# EAGLE design V2_lite (EAGLE 8.5.1)

## Sheet 1 of 8: ATMEGA328p
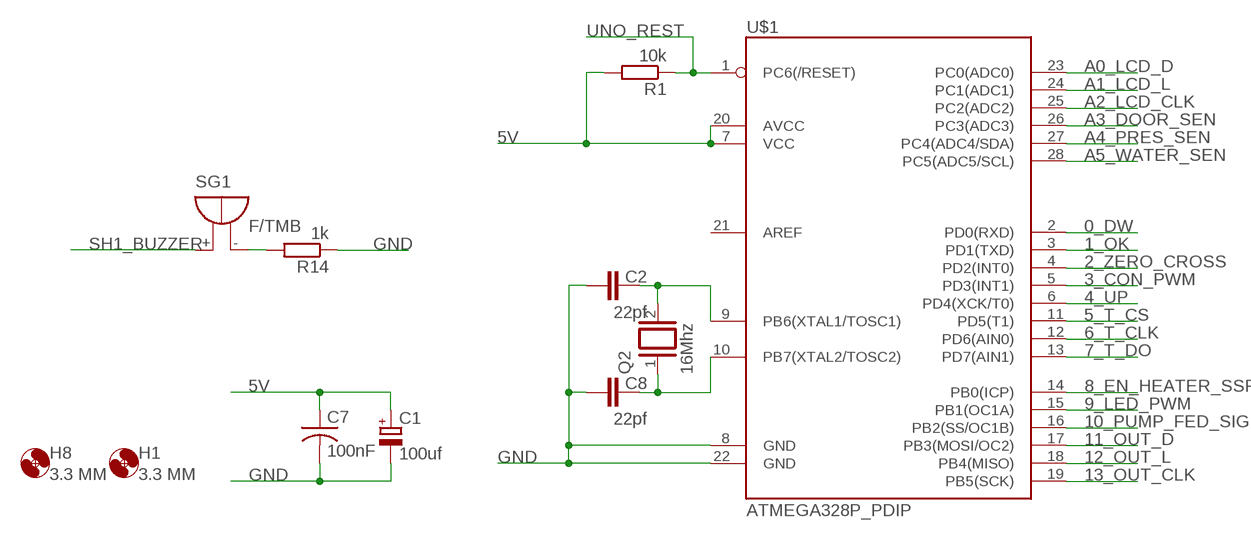
[diagram p0: schematic, sheet 1]

### Parts
C1  100uf  CPOL-EUE3.5-8  [E3,5-8]
C2  22pf  C-EU050-030X075  [C050-030X075]
C7  100nF  C-US050-035X075  [C050-035X075]
C8  22pf  C-EU050-030X075  [C050-030X075]
H1  3.3 MM  MOUNT-HOLE3.3  [3,3]
H8  3.3 MM  MOUNT-HOLE3.3  [3,3]
Q2  16Mhz  XTAL/S  [QS]
R1  10k  R-EU_0207/10  [0207/10]
R14  1k  R-EU_0207/10  [0207/10]
SG1  F/TMB  [F/TMB]
U$1  ATMEGA328P_PDIP  [DIL-28-3]

### Nets
0_DW: U$1.2(PD0(RXD)) ; also sheet 5
1_OK: U$1.3(PD1(TXD)) ; also sheet 5
2_ZERO_CROSS: U$1.4(PD2(INT0)) ; also sheet 4
3_CON_PWM: U$1.5(PD3(INT1)) ; also sheet 3
4_UP: U$1.6(PD4(XCK/T0)) ; also sheet 5
5_T_CS: U$1.11(PD5(T1)) ; also sheet 7
5V: C1.+ C7.1 R1.2 U$1.7(VCC) U$1.20(AVCC) ; also sheet 2,3,4,5,6,7,8
6_T_CLK: U$1.12(PD6(AIN0)) ; also sheet 7
7_T_DO: U$1.13(PD7(AIN1)) ; also sheet 7
8_EN_HEATER_SSR: U$1.14(PB0(ICP)) ; also sheet 5
9_LED_PWM: U$1.15(PB1(OC1A)) ; also sheet 3
10_PUMP_FED_SIG: U$1.16(PB2(SS/OC1B)) ; also sheet 2
11_OUT_D: U$1.17(PB3(MOSI/OC2)) ; also sheet 8
12_OUT_L: U$1.18(PB4(MISO)) ; also sheet 8
13_OUT_CLK: U$1.19(PB5(SCK)) ; also sheet 8
A0_LCD_D: U$1.23(PC0(ADC0)) ; also sheet 3
A1_LCD_L: U$1.24(PC1(ADC1)) ; also sheet 3
A2_LCD_CLK: U$1.25(PC2(ADC2)) ; also sheet 3
A3_DOOR_SEN: U$1.26(PC3(ADC3)) ; also sheet 5
A4_PRES_SEN: U$1.27(PC4(ADC4/SDA)) ; also sheet 5
A5_WATER_SEN: U$1.28(PC5(ADC5/SCL)) ; also sheet 5
GND: C1.- C2.1 C7.2 C8.1 R14.1 U$1.8(GND) U$1.22(GND) ; also sheet 2,3,4,5,6,7,8
N$1: C2.2 Q2.2 U$1.9(PB6(XTAL1/TOSC1))
N$4: C8.2 Q2.1 U$1.10(PB7(XTAL2/TOSC2))
N$62: R14.2 SG1.-
SH1_BUZZER: SG1.+ ; also sheet 8
UNO_REST: R1.1 U$1.1(PC6(/RESET))
Unconnected: U$1.21(AREF)

## Sheet 2 of 8: Current Detect
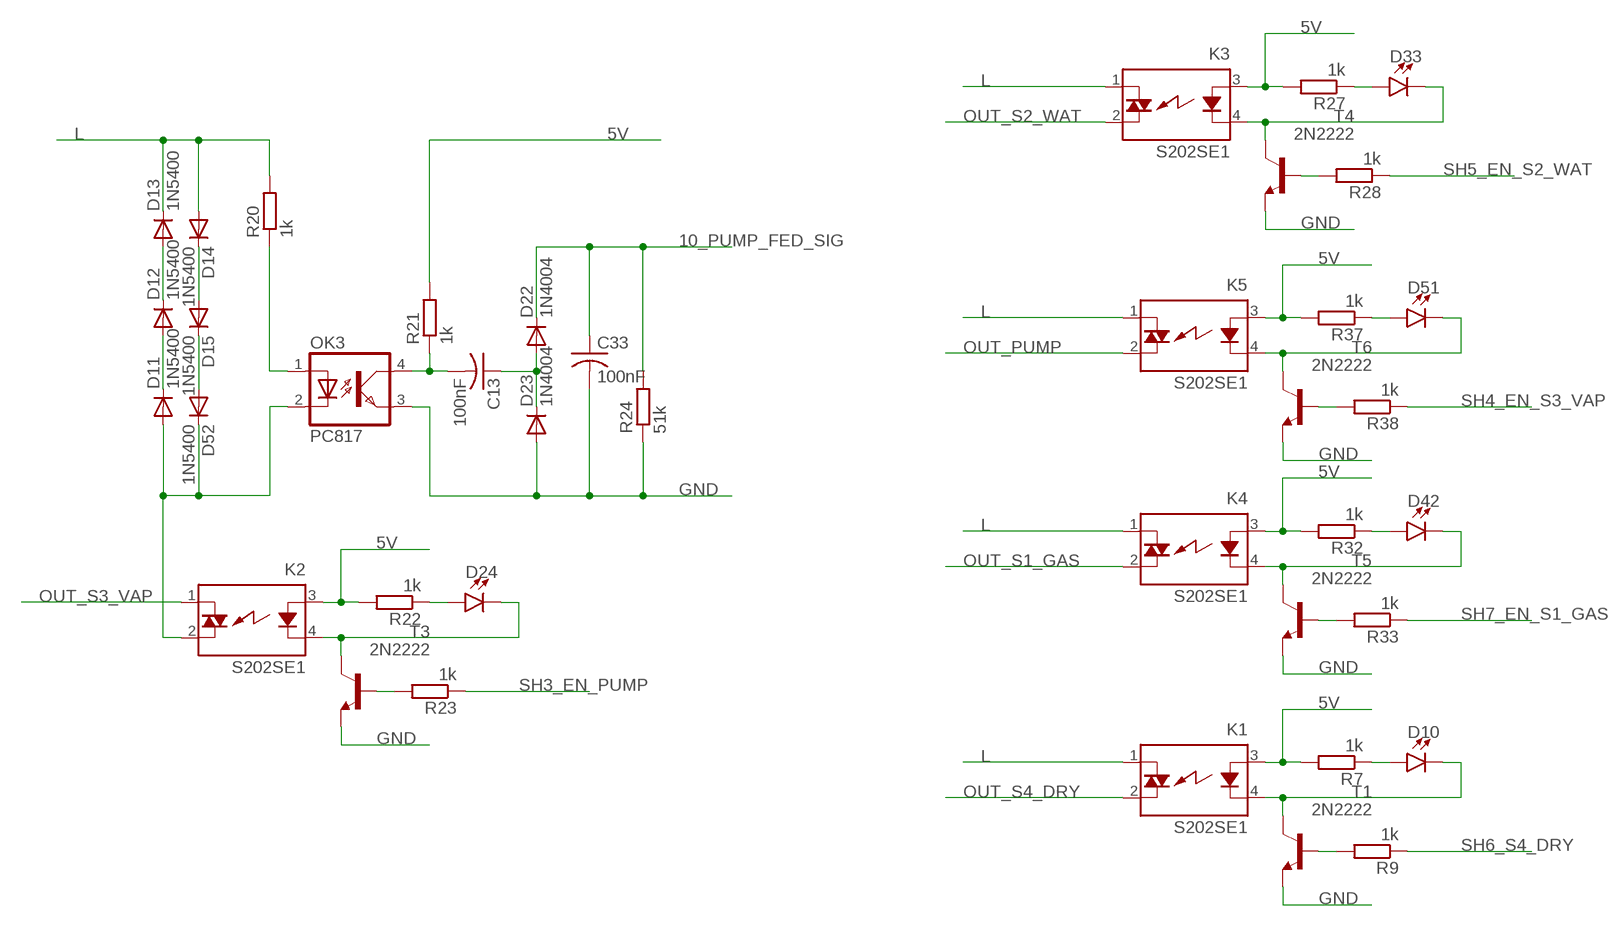
[diagram p1: schematic, sheet 2]

### Parts
C13  100nF  C-US050-035X075  [C050-035X075]
C33  100nF  C-US050-035X075  [C050-035X075]
D10  LED5MM  [LED_5MM]
D11  1N5400  [DO201-15]
D12  1N5400  [DO201-15]
D13  1N5400  [DO201-15]
D14  1N5400  [DO201-15]
D15  1N5400  [DO201-15]
D22  1N4004  [DO41-10]
D23  1N4004  [DO41-10]
D24  LED5MM  [LED_5MM]
D33  LED5MM  [LED_5MM]
D42  LED5MM  [LED_5MM]
D51  LED5MM  [LED_5MM]
D52  1N5400  [DO201-15]
K1  S202SE1  [S2XXEX]
K2  S202SE1  [S2XXEX]
K3  S202SE1  [S2XXEX]
K4  S202SE1  [S2XXEX]
K5  S202SE1  [S2XXEX]
OK3  PC817  [DIL04]
R7  1k  R-EU_0207/10  [0207/10]
R9  1k  R-EU_0207/10  [0207/10]
R20  1k  R-EU_0207/10  [0207/10]
R21  1k  R-EU_0207/10  [0207/10]
R22  1k  R-EU_0207/10  [0207/10]
R23  1k  R-EU_0207/10  [0207/10]
R24  51k  R-EU_0207/10  [0207/10]
R27  1k  R-EU_0207/10  [0207/10]
R28  1k  R-EU_0207/10  [0207/10]
R32  1k  R-EU_0207/10  [0207/10]
R33  1k  R-EU_0207/10  [0207/10]
R37  1k  R-EU_0207/10  [0207/10]
R38  1k  R-EU_0207/10  [0207/10]
T1  2N2222  [TO92-EBC-OVAL]
T3  2N2222  [TO92-EBC-OVAL]
T4  2N2222  [TO92-EBC-OVAL]
T5  2N2222  [TO92-EBC-OVAL]
T6  2N2222  [TO92-EBC-OVAL]

### Nets
5V: K1.3(A) K2.3(A) K3.3(A) K4.3(A) K5.3(A) R7.2 R21.2 R22.2 R27.2 R32.2 R37.2 ; also sheet 1,3,4,5,6,7,8
10_PUMP_FED_SIG: C33.1 D22.C R24.2 ; also sheet 1
GND: C33.2 D23.A OK3.3(EMIT) R24.1 T1.E T3.E T4.E T5.E T6.E ; also sheet 1,3,4,5,6,7,8
L: D13.C D14.A K1.1(DS1) K3.1(DS1) K4.1(DS1) K5.1(DS1) R20.2 ; also sheet 5
N$8: D10.K(C) K1.4(K) T1.C
N$10: D11.C D12.A
N$11: D10.A R7.1
N$13: R9.2 T1.B
N$15: D12.C D13.A
N$17: D14.C D15.A
N$18: D15.C D52.A
N$19: OK3.1(A) R20.1
N$20: C13.2 OK3.4(COL) R21.1
N$21: C13.1 D22.A D23.C
N$23: D24.A R22.1
N$24: D24.K(C) K2.4(K) T3.C
N$25: R23.2 T3.B
N$34: D33.A R27.1
N$35: D33.K(C) K3.4(K) T4.C
N$36: R28.2 T4.B
N$45: D42.A R32.1
N$46: D42.K(C) K4.4(K) T5.C
N$51: D11.A D52.C K2.2(DS2) OK3.2(C)
N$52: R33.2 T5.B
N$64: D51.A R37.1
N$65: D51.K(C) K5.4(K) T6.C
N$66: R38.2 T6.B
OUT_PUMP: K5.2(DS2) ; also sheet 5
OUT_S1_GAS: K4.2(DS2) ; also sheet 5
OUT_S2_WAT: K3.2(DS2) ; also sheet 5
OUT_S3_VAP: K2.1(DS1) ; also sheet 5
OUT_S4_DRY: K1.2(DS2) ; also sheet 5
SH3_EN_PUMP: R23.1 ; also sheet 8
SH4_EN_S3_VAP: R38.1 ; also sheet 8
SH5_EN_S2_WAT: R28.1 ; also sheet 8
SH6_S4_DRY: R9.1 ; also sheet 8
SH7_EN_S1_GAS: R33.1 ; also sheet 8

## Sheet 3 of 8: LCD_Shift
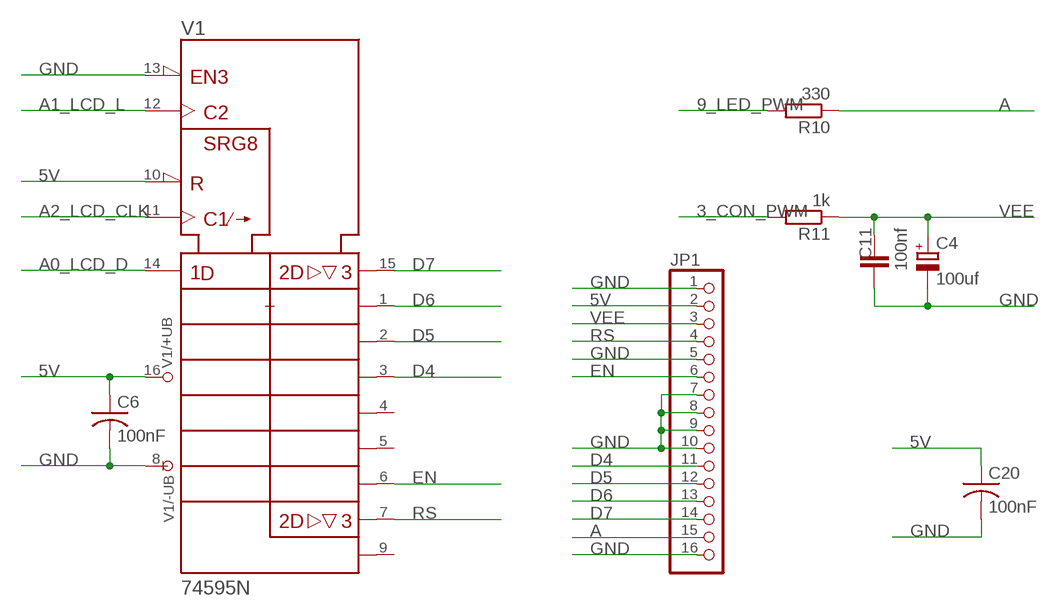
[diagram p2: schematic, sheet 3]

### Parts
C4  100uf  CPOL-EUE3.5-8  [E3,5-8]
C6  100nF  C-US050-035X075  [C050-035X075]
C11  100nf  C-EU050-030X075  [C050-030X075]
C20  100nF  C-US050-035X075  [C050-035X075]
JP1  PINHD-1X16  [1X16]
R10  330  R-EU_0207/10  [0207/10]
R11  1k  R-EU_0207/10  [0207/10]
V1  74595N  [DIL16]

### Nets
3_CON_PWM: R11.2 ; also sheet 1
5V: C6.1 C20.1 JP1.2 V1.10(!SRCLR) V1.16(+UB) ; also sheet 1,2,4,5,6,7,8
9_LED_PWM: R10.2 ; also sheet 1
A: JP1.15 R10.1
A0_LCD_D: V1.14(SER) ; also sheet 1
A1_LCD_L: V1.12(RCK) ; also sheet 1
A2_LCD_CLK: V1.11(SRCK) ; also sheet 1
D4: JP1.11 V1.3(QD)
D5: JP1.12 V1.2(QC)
D6: JP1.13 V1.1(QB)
D7: JP1.14 V1.15(QA)
EN: JP1.6 V1.6(QG)
GND: C4.- C6.2 C11.1 C20.2 JP1.1 JP1.5 JP1.7 JP1.8 JP1.9 JP1.10 JP1.16 V1.8(-UB) V1.13(!G) ; also sheet 1,2,4,5,6,7,8
RS: JP1.4 V1.7(QH)
VEE: C4.+ C11.2 JP1.3 R11.1
Unconnected: V1.4(QE) V1.5(QF) V1.9(QH*)

## Sheet 4 of 8: Zero_Cross Detect
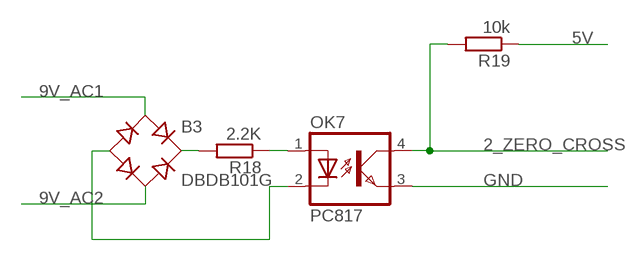
[diagram p3: schematic, sheet 4]

### Parts
B3  DBDB101G  [DB]
OK7  PC817  [DIL04]
R18  2.2K  R-EU_0207/10  [0207/10]
R19  10k  R-EU_0207/10  [0207/10]

### Nets
2_ZERO_CROSS: OK7.4(COL) R19.2 ; also sheet 1
5V: R19.1 ; also sheet 1,2,3,5,6,7,8
9V_AC1: B3.AC1 ; also sheet 5,6
9V_AC2: B3.AC2 ; also sheet 5,6
GND: OK7.3(EMIT) ; also sheet 1,2,3,5,6,7,8
N$47: B3.+ R18.2
N$48: OK7.1(A) R18.1
N$49: B3.- OK7.2(C)

## Sheet 5 of 8: Terminals
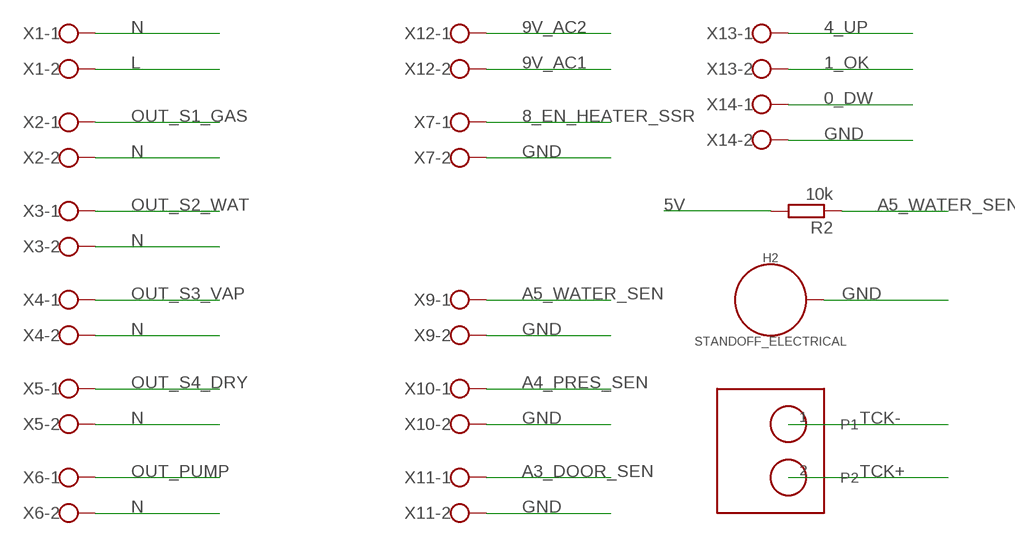
[diagram p4: schematic, sheet 5]

### Parts
H2  STANDOFF_ELECTRICAL  [STANDOFF-ELECTRICAL]
R2  10k  R-EU_0207/10  [0207/10]
U$2  THERMO_CONNECT  [HW-550]
X1  W237-102  [W237-102]
X2  W237-102  [W237-102]
X3  W237-102  [W237-102]
X4  W237-102  [W237-102]
X5  W237-102  [W237-102]
X6  W237-102  [W237-102]
X7  W237-102  [W237-102]
X9  W237-102  [W237-102]
X10  W237-102  [W237-102]
X11  W237-102  [W237-102]
X12  W237-102  [W237-102]
X13  W237-102  [W237-102]
X14  W237-102  [W237-102]

### Nets
0_DW: X14.1 ; also sheet 1
1_OK: X13.2 ; also sheet 1
4_UP: X13.1 ; also sheet 1
5V: R2.2 ; also sheet 1,2,3,4,6,7,8
8_EN_HEATER_SSR: X7.1 ; also sheet 1
9V_AC1: X12.2 ; also sheet 4,6
9V_AC2: X12.1 ; also sheet 4,6
A3_DOOR_SEN: X11.1 ; also sheet 1
A4_PRES_SEN: X10.1 ; also sheet 1
A5_WATER_SEN: R2.1 X9.1 ; also sheet 1
GND: H2.P1 X7.2 X9.2 X10.2 X11.2 X14.2 ; also sheet 1,2,3,4,6,7,8
L: X1.2 ; also sheet 2
N: X1.1 X2.2 X3.2 X4.2 X5.2 X6.2
OUT_PUMP: X6.1 ; also sheet 2
OUT_S1_GAS: X2.1 ; also sheet 2
OUT_S2_WAT: X3.1 ; also sheet 2
OUT_S3_VAP: X4.1 ; also sheet 2
OUT_S4_DRY: X5.1 ; also sheet 2
TCK+: U$2.2 ; also sheet 7
TCK-: U$2.1 ; also sheet 7

## Sheet 6 of 8: POWER
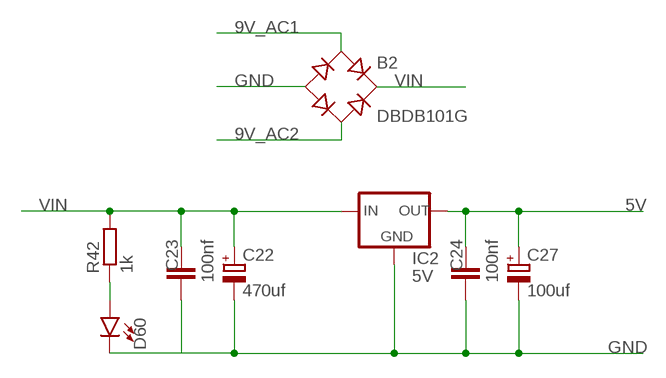
[diagram p5: schematic, sheet 6]

### Parts
B2  DBDB101G  [DB]
C22  470uf  CPOL-EUE3.5-8  [E3,5-8]
C23  100nf  C-EU050-030X075  [C050-030X075]
C24  100nf  C-EU050-030X075  [C050-030X075]
C27  100uf  CPOL-EUE3.5-8  [E3,5-8]
D60  LED5MM  [LED_5MM]
IC2  5V  V_REG_78XXSIDE  [78XXL]
R42  1k  R-EU_0207/10  [0207/10]

### Nets
5V: C24.2 C27.+ IC2.OUT ; also sheet 1,2,3,4,5,7,8
9V_AC1: B2.AC1 ; also sheet 4,5
9V_AC2: B2.AC2 ; also sheet 4,5
GND: B2.- C22.- C23.1 C24.1 C27.- D60.K(C) IC2.GND ; also sheet 1,2,3,4,5,7,8
N$74: D60.A R42.1
VIN: B2.+ C22.+ C23.2 IC2.IN R42.2

## Sheet 7 of 8: Thermocoupler
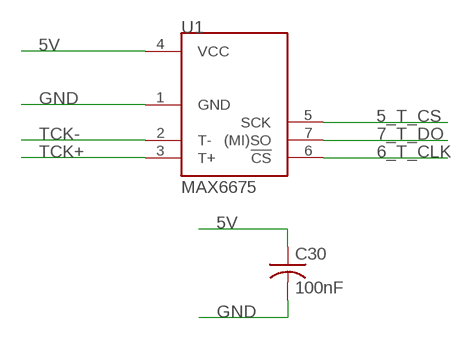
[diagram p6: schematic, sheet 7]

### Parts
C30  100nF  C-US050-035X075  [C050-035X075]
U1  MAX6675  [SOIC8]

### Nets
5_T_CS: U1.5(SCK) ; also sheet 1
5V: C30.1 U1.4(VCC) ; also sheet 1,2,3,4,5,6,8
6_T_CLK: U1.6(!CS) ; also sheet 1
7_T_DO: U1.7((MI)SO) ; also sheet 1
GND: C30.2 U1.1(GND) ; also sheet 1,2,3,4,5,6,8
TCK+: U1.3(T+) ; also sheet 5
TCK-: U1.2(T-) ; also sheet 5

## Sheet 8 of 8: Shift Outputs
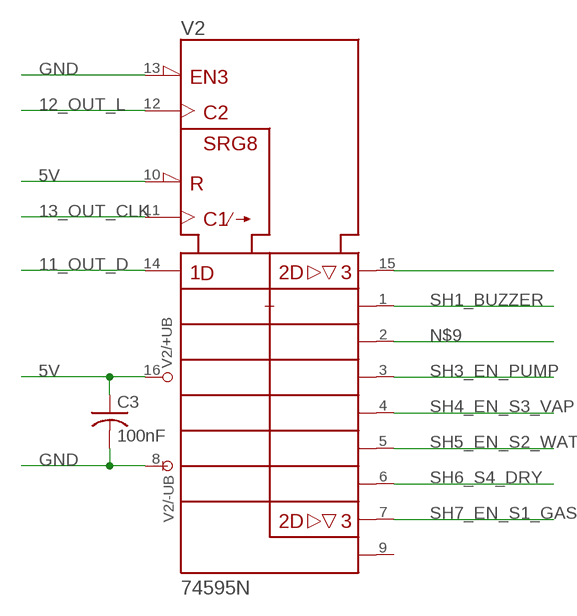
[diagram p7: schematic, sheet 8]

### Parts
C3  100nF  C-US050-035X075  [C050-035X075]
V2  74595N  [DIL16]

### Nets
5V: C3.1 V2.10(!SRCLR) V2.16(+UB) ; also sheet 1,2,3,4,5,6,7
11_OUT_D: V2.14(SER) ; also sheet 1
12_OUT_L: V2.12(RCK) ; also sheet 1
13_OUT_CLK: V2.11(SRCK) ; also sheet 1
GND: C3.2 V2.8(-UB) V2.13(!G) ; also sheet 1,2,3,4,5,6,7
N$9: V2.2(QC)
N$14: V2.15(QA)
SH1_BUZZER: V2.1(QB) ; also sheet 1
SH3_EN_PUMP: V2.3(QD) ; also sheet 2
SH4_EN_S3_VAP: V2.4(QE) ; also sheet 2
SH5_EN_S2_WAT: V2.5(QF) ; also sheet 2
SH6_S4_DRY: V2.6(QG) ; also sheet 2
SH7_EN_S1_GAS: V2.7(QH) ; also sheet 2
Unconnected: V2.9(QH*)

## Library data of the parts
B2 B3 = rectifier:DB?*G: Single Phase 1.0 AMP Glass Passivated Bridge Rectifier Taiwan Semiconductor Co.,Ltd. - TSC Source: http://www.taiwansemi.com/TSCbig5/ezcatfiles/cust/img/img/db101g.pdf http://www.ts.com.tw/db/pictures/modules/PDT/PDT060207001/DBLS201G.pdf
C1 C4 C22 C27 = rcl:CPOL-EU: POLARIZED CAPACITOR, European symbol
C2 C8 C11 C23 C24 = rcl:C-EU: CAPACITOR, European symbol
C3 C6 C7 C13 C20 C30 C33 = rcl:C-US: CAPACITOR, American symbol; SPICEPREFIX: C
D10 D24 D33 D42 D51 D60 = SparkFun-LED:LED: LED (Generic) Standard schematic elements and footprints for 5mm, 3mm, 1206, and 0603 sized LEDs. Generic LEDs with no color specified.
D11-D15 D52 = diode:1N5400: DIODE standard rectifier, 3 A, 50 V (Motorola)
D22 D23 = adafruit:1N4004: DIODE General purpose 1N400x type rectifier (With bigger pads) http://www.ladyada.net/library/pcb/eaglelibrary.html
H1 H8 = holes:MOUNT-HOLE: MOUNTING HOLE with drill center marker
H2 = SparkFun-Hardware:STANDOFF_ELECTRICAL: Stand Off Drill holes with an electrical connection. For example, use these to ground your board to a chassis. Example SparkFun Products Screw - Phillips Head (1/4", 4-40, 10 pack) <https://www.sparkfun.com/products/10453> (PRT-10453) Screw - Phillips Head (1/2", 4-40, 10 pack) <https://www.sparkfun.com/products/10452> (PRT-10452) Screw - Phillips Head (3/4", 4-40, 10 pack) <https://www.sparkfun.com/products/10451> (PRT-10451) Screw - Phillips Head (1", 4-40, 10 pack) <https://www.sparkfun.com/products/10450> (PRT-10450)
IC2 = SparkFun:V_REG_78XX: Voltage Regulator Standard 7805 5V regulator. IGO (Input Ground Output). Spark Fun Electronics SKU : COM-00107
JP1 = pinhead:PINHD-1X16: PIN HEADER
K1-K5 = relay:S2*: SIP Type SSR for Medium Power Control SHARP Source: 168149-da-01-en-Solid_State_Relais_S_202_SE1_SE2.pdf; OC_FARNELL: unknown; OC_NEWARK: unknown
OK3 OK7 = optocoupler-2:PC817: SHARP OPTO COUPLER
Q2 = special:XTAL/S: CRYSTAL
R1 R2 R7 R9-R11 R14 R18-R24 R27 R28 R32 R33 R37 R38 R42 = rcl:R-EU_: RESISTOR, European symbol
SG1 = buzzer:F/TMB: BUZZER Source: Buerklin; OC_FARNELL: unknown; OC_NEWARK: unknown
T1 T3-T6 = adafruit:2N2222: NPN TRANSISTOR Big oval pads
U1 = SparkFun-Retired:MAX6675: Cold-Junction-Compensated K-Thermocoupleto-Digital Converter (0°C to +1024°C) The MAX6675 performs cold-junction compensation and digitizes the signal from a type-K thermocouple. The data is output in a 12-bit resolution, SPI™-compatible, read-only format. This converter resolves temperatures to 0.25°C, allows readings as high as +1024°C, and exhibits thermocouple accuracy of 8LSBs for temperatures ranging from 0°C to +700°C. Dead Prototype: IC-12512; PROD_ID: IC-12512
U$1 = FaBo-MPU:ATMEGA328P_PDIP
U$2 = thermo_connector:THERMO_CONNECT
V1 V2 = 74ttl-din:74*595: 8-bit SHIFT REGISTER, output latch
X1-X7 X9-X14 = con-wago-500:W237-102: WAGO SCREW CLAMP; MPN: 237-102; OC_FARNELL: unknown; OC_NEWARK: 70K9898

## Board
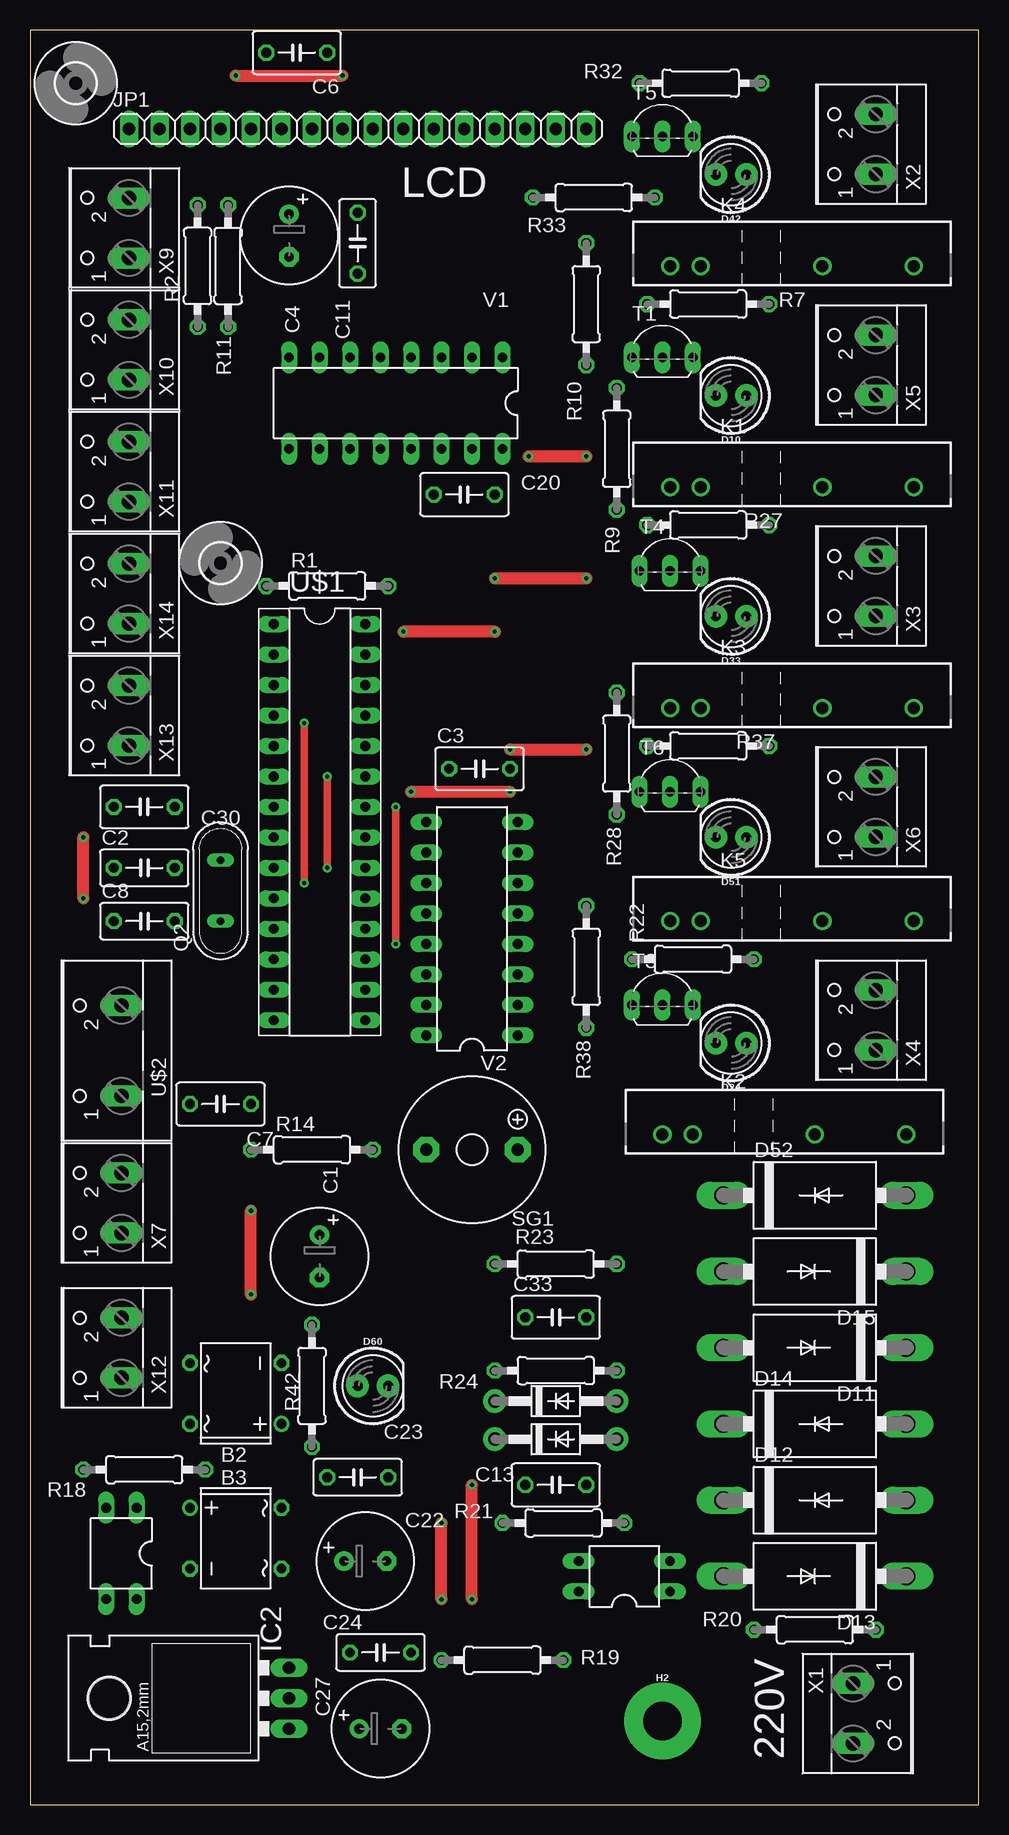
[diagram p8: board, top side]
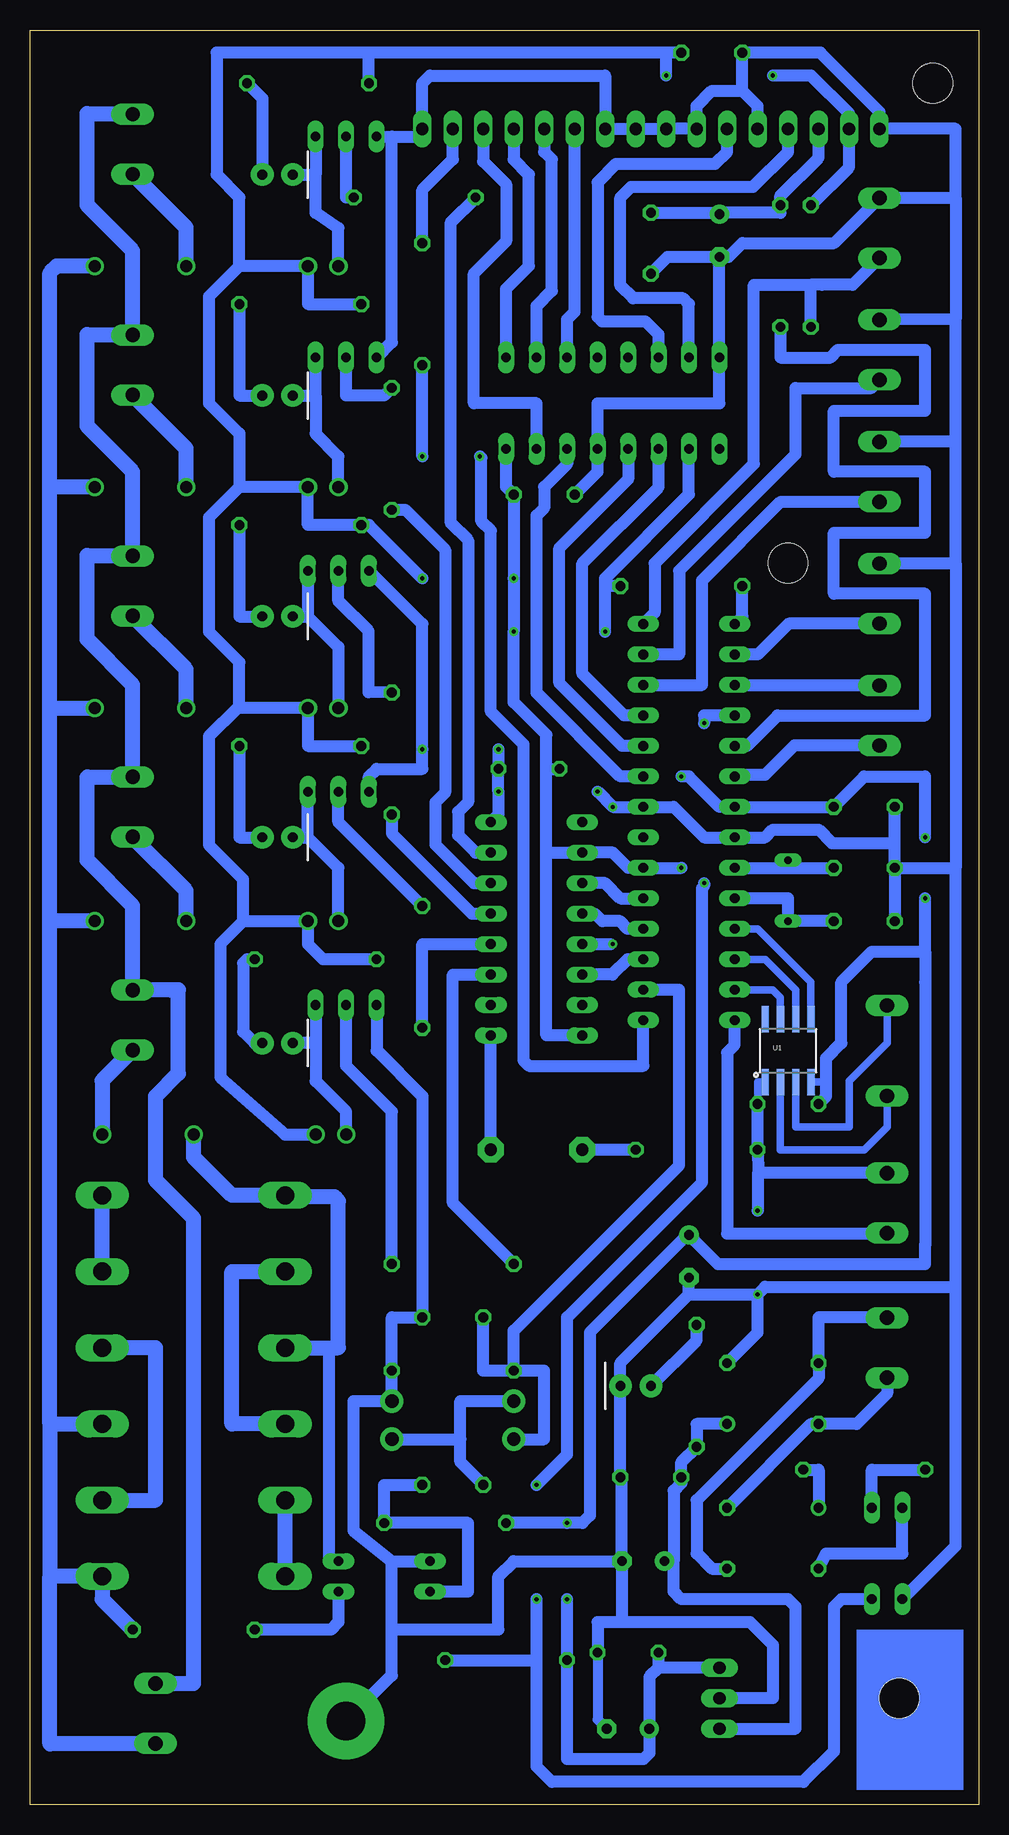
[diagram p9: board, bottom side, seen from below]

Size 79.05 x 147.94 mm. Coordinates in mm from the lower left corner, seen from the top.
Outline: 0,0 79.05,0 79.05,147.94 0,147.94 0,0
Copper layers (1*16): Top 0.035mm / dielectric 1.5mm / Bottom 0.035mm
Design rules "default *": minimum track width 6mil, minimum drill 0.35mm, track to track 35mil, track to pad 35mil, pad to pad 6mil, via to via 6mil, smd to smd 6mil, copper to edge 40mil, drill to drill 6mil, minimum pad ring 10mil, minimum via ring 8mil, stop-mask expansion 4mil, vias tented up to drill 0mil, thermal gap 10mil

### Footprints (pad centres in the part's own frame; a part is rotated, then mirrored left to right if it is on the bottom)
DB = drill 0.813: + -2.54,-3.81 | drill 0.813 octagon: - 2.54,-3.81; AC1 2.54,3.81; AC2 -2.54,3.81
E3,5-8 = drill 0.813 pad 1.6: + -1.778,0 | drill 0.813 pad 1.6 octagon: - 1.778,0
C050-030X075 = drill 0.813 octagon: 1 -2.54,0; 2 2.54,0
C050-035X075 = drill 0.813 octagon: 1 -2.54,0; 2 2.54,0
LED_5MM = drill 0.813 pad 1.88: A -1.27,0; K 1.27,0
DO201-15 = drill 1.499 long: A 7.62,0; C -7.62,0
DO41-10 = drill 1.118 pad 1.93: A 5.08,0; C -5.08,0
3,3 = hole 3.3: 0,0
STANDOFF-ELECTRICAL = drill 3.2 pad 6.35: P1 0,0
78XXL = drill 1.016 long: GND 0,-3.81; IN -2.54,-3.81; OUT 2.54,-3.81 | hole 3.302: 0,11.176
1X16 = drill 1.016 long: 1 -19.05,0; 2 -16.51,0; 3 -13.97,0; 4 -11.43,0; 5 -8.89,0; 6 -6.35,0; 7 -3.81,0; 8 -1.27,0; 9 1.27,0; 10 3.81,0; 11 6.35,0; 12 8.89,0; 13 11.43,0; 14 13.97,0; 15 16.51,0; 16 19.05,0
S2XXEX = drill 1: 1 -12.7,0; 2 -5.08,0; 3 5.08,0; 4 7.62,0
DIL04 = drill 0.813 long: 1 -1.27,-3.81; 2 1.27,-3.81; 3 1.27,3.81; 4 -1.27,3.81
QS = drill 0.61 long: 1 -2.54,0; 2 2.54,0
0207/10 = drill 0.813 octagon: 1 -5.08,0; 2 5.08,0
F/TMB = drill 1.016 pad 2.159 octagon: + 3.81,0; - -3.81,0
TO92-EBC-OVAL = drill 0.813 long: B 0,-1.27; C 2.54,-1.27; E -2.54,-1.27
SOIC8 = smd 0.61 x 2.21: 1 -1.905,-2.616; 2 -0.635,-2.616; 3 0.635,-2.616; 4 1.905,-2.616; 5 1.905,2.616; 6 0.635,2.616; 7 -0.635,2.616; 8 -1.905,2.616
DIL-28-3 = drill 0.813 long: 1 -15.24,-3.81; 2 -12.7,-3.81; 3 -10.16,-3.81; 4 -7.62,-3.81; 5 -5.08,-3.81; 6 -2.54,-3.81; 7 0,-3.81; 8 2.54,-3.81; 9 5.08,-3.81; 10 7.62,-3.81; 11 10.16,-3.81; 12 12.7,-3.81; 13 15.24,-3.81; 14 17.78,-3.81; 15 17.78,3.81; 16 15.24,3.81; 17 12.7,3.81; 18 10.16,3.81; 19 7.62,3.81; 20 5.08,3.81; 21 2.54,3.81; 22 0,3.81; 23 -2.54,3.81; 24 -5.08,3.81; 25 -7.62,3.81; 26 -10.16,3.81; 27 -12.7,3.81; 28 -15.24,3.81
HW-550 = drill 1.194 long: 1 -3.77,0; 2 3.77,0
DIL16 = drill 0.813 long: 1 -8.89,-3.81; 2 -6.35,-3.81; 3 -3.81,-3.81; 4 -1.27,-3.81; 5 1.27,-3.81; 6 3.81,-3.81; 7 6.35,-3.81; 8 8.89,-3.81; 9 8.89,3.81; 10 6.35,3.81; 11 3.81,3.81; 12 1.27,3.81; 13 -1.27,3.81; 14 -3.81,3.81; 15 -6.35,3.81; 16 -8.89,3.81
W237-102 = drill 1.194 long: 1 -2.5,-1.27; 2 2.5,-1.27

### Placement (x,y rotation side)
B2  17.14,34.29 90 top
B3  17.14,22.23 270 top
C1  24.13,45.72 270 top
C2  9.53,78.11 0 top
C3  37.47,86.36 0 top
C4  21.59,130.81 270 top
C6  22.23,146.05 180 top
C7  15.88,58.42 0 top
C8  9.53,73.66 0 top
C11  27.3,130.18 90 top
C13  43.81,26.67 0 top
C20  36.2,109.22 180 top
C22  27.94,20.32 0 top
C23  27.3,27.3 180 top
C24  29.21,12.7 180 top
C27  29.21,6.35 0 top
C30  9.53,83.19 180 top
C33  43.81,40.64 0 top
D10  58.42,117.47 180 top
D11  65.41,38.1 180 top
D12  65.41,25.4 0 top
D13  65.41,19.05 180 top
D14  65.41,31.75 0 top
D15  65.41,44.45 180 top
D22  43.81,30.48 0 top
D23  43.81,33.66 0 top
D24  58.42,63.5 180 top
D33  58.42,99.06 180 top
D42  58.42,135.89 180 top
D51  58.42,80.64 180 top
D52  65.41,50.8 0 top
D60  28.57,34.92 0 top
H1  15.88,103.5 90 top
H2  52.7,6.99 0 top
H8  3.81,143.51 0 top
IC2  17.78,8.89 90 top
JP1  27.3,139.7 0 top
K1  60.96,109.86 180 top
K2  60.33,55.88 180 top
K3  60.96,91.44 180 top
K4  60.96,128.27 180 top
K5  60.96,73.66 180 top
OK3  49.53,19.05 90 top
OK7  7.62,20.95 180 top
Q2  15.88,76.2 90 top
R1  24.77,101.6 0 top
R2  13.97,128.27 90 top
R7  56.52,125.09 180 top
R9  48.9,113.03 90 top
R10  46.35,125.09 270 top
R11  16.51,128.27 270 top
R14  23.5,54.61 0 top
R18  9.53,27.94 0 top
R19  39.37,12.06 0 top
R20  65.41,14.61 0 top
R21  44.45,23.5 180 top
R22  55.24,70.48 180 top
R23  43.81,45.09 0 top
R24  43.81,36.2 180 top
R27  56.52,106.68 180 top
R28  48.9,87.63 90 top
R32  55.88,143.51 180 top
R33  46.99,133.99 0 top
R37  56.52,88.27 180 top
R38  46.35,69.85 90 top
R42  23.5,34.92 270 top
SG1  36.83,54.61 0 top
T1  52.7,121.92 0 top
T3  52.7,67.94 0 top
T4  53.34,104.14 0 top
T5  52.7,140.34 0 top
T6  53.34,85.72 0 top
U1  15.88,62.87 0 bottom
U$1  24.13,83.19 270 top
U$2  7.62,62.87 90 top
V1  30.48,116.84 180 top
V2  36.83,73.03 90 top
X1  69.85,7.62 270 top
X2  69.22,138.43 90 top
X3  69.22,101.6 90 top
X4  69.22,65.41 90 top
X5  69.22,120.02 90 top
X6  69.22,83.19 90 top
X7  6.35,50.16 90 top
X9  6.99,131.44 90 top
X10  6.99,121.28 90 top
X11  6.99,111.12 90 top
X12  6.35,38.1 90 top
X13  6.99,90.81 90 top
X14  6.99,100.97 90 top

### Tracks (layer width: path | path; a pad name or v marks a point on that pad's centre or on a via)
0_DW
  Bottom 1.016: X14.1 15.84,98.47 18.41,95.89 U$1.2
1_OK
  Bottom 1.016: 8.26,93.34 X13.2 20.28,93.31 U$1.3
2_ZERO_CROSS  (via drill 0.35)
  Top 0.61: v22.86,90.17 v22.86,76.83
  Top 1.016: v36.83,17.14 v36.83,26.67
  Bottom 1.016: OK7.4 11.43,17.14 12.06,16.51 12.06,4.45 14.61,1.91 35.56,1.91 36.83,3.17 36.83,12.06 | v36.83,26.67 34.29,29.21 34.29,40.64 23.04,51.89 23.04,76.42 22.86,76.59 v22.86,76.83 | 36.83,12.06 v36.83,17.14 | R19.2 36.83,12.06 | U$1.4 22.86,90.81 v22.86,90.17
3_CON_PWM
  Bottom 1.016: U$1.5 19.29,88.27 16.75,90.81 4.45,90.81 4.45,100.97 12.06,100.97 12.06,106.05 4.45,106.05 4.45,111.12 12.06,111.12 12.06,116.2 4.45,116.2 4.45,121.28 11.7,121.28 12.33,120.65 16.51,120.65 R11.2
4_UP
  Bottom 1.016: X13.1 15.35,88.31 17.78,85.88 20.17,85.88 U$1.6
5_T_CS
  Bottom 0.61: U1.5 13.97,68.58 18.41,73.03 U$1.11
5V  (via drill 0.35)
  Top 0.61: v24.77,78.11 v24.77,85.72
  Top 1.016: v34.29,17.14 v34.29,23.5 | v4.45,75.56 v4.45,80.64 | v17.14,144.15 v26.04,144.15 | v38.73,97.79 v31.11,97.79 | v46.35,102.23 v38.73,102.23
  Bottom 0.61: 12.7,62.23 12.7,60.33 | 12.7,59.05 12.7,60.33 | U1.4 12.78,60.25 12.7,60.33
  Bottom 1.016: IC2.OUT 26.67,11.43 | 26.67,11.43 27.43,10.67 C27.+ 27.43,4.32 27.94,3.81 34.29,3.81 R19.1 v34.29,17.14 | 26.67,11.43 C24.2 | R21.2 v34.29,23.5 33.02,23.5 32.38,24.13 32.38,39.37 24.26,47.5 C1.+ 21.72,45.09 4.45,45.09 4.45,46.7 4.43,46.72 4.43,68.57 4.45,68.58 4.45,71.12 | R32.2 50.8,146.05 | 50.8,146.05 63.5,146.05 63.5,135.89 61.59,133.99 61.59,128.27 | R7.2 55.88,125.09 K4.3 61.59,128.27 | 61.59,128.27 64.14,125.73 64.14,116.84 61.59,114.3 61.59,109.86 | 61.59,109.86 K1.3 55.88,106.68 R27.2 50.8,106.68 v46.35,102.23 | 61.59,109.86 64.14,107.31 64.14,97.79 61.59,95.25 61.59,91.44 | R37.2 55.88,88.27 K3.3 61.59,91.44 | 61.59,91.44 61.75,91.44 64.14,89.05 64.14,80.01 61.28,77.15 61.28,73.66 | K2.3 57.78,55.88 63.18,60.64 63.18,71.75 61.28,73.66 | v26.04,144.15 26.04,146.05 | 26.04,146.05 50.8,146.05 | R2.2 10.79,136.53 JP1.2 10.79,140.97 13.96,144.15 v17.14,144.15 | v4.45,80.64 4.45,85.72 9.53,85.72 C30.1 U$1.7 21.59,83.19 24.13,85.72 v24.77,85.72 | V1.10 24.13,109.22 31.11,102.23 31.11,101.6 | V1.16 39.37,109.86 C20.1 v38.73,102.23 v38.73,97.79 38.73,91.92 36.02,89.2 36.02,86.36 | R22.2 54.61,70.48 55.88,71.75 K5.3 61.28,73.66 | v31.11,97.79 31.11,101.6 | R1.2 31.11,101.6 | v24.77,78.11 U$1.20 29.21,78.11 30.48,79.38 V2.10 36.02,79.38 | C7.1 12.7,59.05 12.7,62.23 11.43,63.5 11.43,68.58 8.89,71.12 4.45,71.12 | V2.16 36.02,64.14 36.02,79.38 | 36.02,79.38 36.02,86.36 | 36.02,86.36 C3.1 | 4.45,71.12 v4.45,75.56 | C6.1 26.04,146.05
6_T_CLK
  Bottom 0.61: U1.6 15.24,67.94 17.78,70.48 U$1.12
7_T_DO
  Bottom 0.61: U$1.13 17.14,67.94 16.51,67.31 U1.7
8_EN_HEATER_SSR
  Bottom 1.016: X7.1 8.21,47.62 20.95,47.62 20.95,62.71 20.32,63.35 U$1.14
9_LED_PWM  (via drill 0.35)
  Top 1.016: v46.35,112.39 v41.56,112.39
  Bottom 1.016: v46.35,112.39 R10.2 | U$1.15 27.94,61.59 37.47,61.59 37.92,62.05 37.92,88.41 40.64,91.13 40.64,106.2 41.43,106.99 41.43,112.27 v41.56,112.39
9V_AC1
  Bottom 1.016: B3.AC1 22.23,19.68 23.5,20.95 23.5,25.4 13.34,35.56 B2.AC1 13.34,40.6 13.29,40.64 7.66,40.64 X12.2
9V_AC2
  Bottom 1.016: B3.AC2 13.97,31.75 B2.AC2 10.16,31.75 7.62,34.29 X12.1
10_PUMP_FED_SIG
  Bottom 1.016: D22.C 36.2,30.48 36.2,36.2 R24.2 | R24.2 41.27,36.2 C33.1 | R24.2 38.73,39.52 24.94,53.32 24.94,67.94 U$1.16
11_OUT_D
  Bottom 1.016: U$1.17 29.23,70.48 30.5,69.22 V2.14
12_OUT_L
  Bottom 1.016: 29.21,73.03 U$1.18 29.23,73.03 29.87,73.66 31.36,73.66 31.99,74.3 V2.12
13_OUT_CLK
  Bottom 1.016: U$1.19 29.84,75.56 31.11,76.83 V2.11
A
  Bottom 1.016: JP1.15 43.81,137.16 46.35,134.62 R10.1
A0_LCD_D
  Bottom 1.016: V1.14 34.29,111.76 36.2,109.86 36.2,108.1 36.83,107.47 36.83,92.71 29.84,85.72 U$1.23
A1_LCD_L
  Bottom 1.016: V1.12 29.21,110.49 34.92,104.78 34.92,93.5 29.69,88.27 U$1.24
A2_LCD_CLK
  Bottom 1.016: V1.11 26.67,109.86 33.02,103.5 33.02,94.29 29.54,90.81 U$1.25
A3_DOOR_SEN
  Bottom 1.016: X11.1 16.47,108.62 23.04,102.06 23.04,93.34 U$1.26
A4_PRES_SEN
  Bottom 1.016: 8.29,118.75 X10.1 8.93,118.11 15.24,118.11 15.24,112.57 24.94,102.87 | 24.94,102.87 24.94,95.89 U$1.27 | 24.94,102.87 | 22.4,105.41 24.94,102.87
A5_WATER_SEN
  Bottom 1.016: 13.97,126.7 13.04,126.7 10.5,126.7 X9.1 | 13.97,126.7 18.71,126.7 18.71,111.79 27,103.5 27,99.36 U$1.28 | R2.1 13.97,126.7
D4
  Bottom 1.016: V1.3 34.29,123.83 33.66,124.46 JP1.11
D5
  Bottom 1.016: JP1.12 36.2,137.79 35.56,137.16 35.56,126.21 36.83,124.94 V1.2
D6
  Bottom 1.016: JP1.13 38.73,137.16 37.47,135.89 37.47,128.27 39.37,126.36 V1.1
D7
  Bottom 1.016: JP1.14 41.27,137.01 39.37,135.1 39.37,130.33 42.06,127.64 42.06,116.84 36.83,116.84 V1.15
EN
  Bottom 1.016: V1.6 26.67,122.56 27.79,123.67 31.38,123.67 31.75,124.04 31.75,135.25 30.23,136.78 21.97,136.78 20.95,137.79 JP1.6
GND  (via drill 0.35)
  Top 0.61: v30.48,71.75 v30.48,83.19
  Top 1.016: v31.75,84.45 v40.01,84.45 | v18.41,42.55 v18.41,49.53 | v40.01,87.99 v46.35,87.99
  Bottom 0.61: U1.1 18.41,60.25 C7.2 | 30.66,71.75 v30.48,71.75
  Bottom 0.813: C24.1 31.75,7.11 C27.-
  Bottom 1.016: C24.1 31.75,15.24 29.84,15.24 | 29.84,15.24 19.05,15.24 17.14,13.34 17.14,8.89 IC2.GND | 48.9,14.61 40.01,14.61 40.01,19.05 38.73,20.32 C22.- | 48.9,14.61 48.9,20.32 | 48.9,20.32 OK3.3 | 48.9,20.32 52.07,22.86 52.07,33.66 D23.A R24.1 48.9,40.64 C33.2 46.35,59.05 50.16,62.87 T3.E | C2.1 C8.1 | 24.13,42.55 29.84,36.83 D60.K C23.1 29.72,27.18 C22.- | 24.13,42.55 v18.41,42.55 | B2.- 18.41,39.37 v18.41,42.55 | OK7.3 1.91,21.59 1.91,43.18 | 1.91,43.18 1.91,78.11 | X14.2 8.21,103.5 1.91,103.5 | 1.91,103.5 1.91,78.11 | 1.91,103.5 1.91,113.67 | 1.91,113.67 1.91,123.83 | X10.2 8.29,123.78 1.91,123.83 | X11.2 8.21,113.67 1.91,113.67 | 1.91,133.99 8.21,133.99 X9.2 12.03,130.18 19.68,130.18 20.83,129.03 C4.- | 1.91,133.99 1.91,123.83 | 1.91,133.99 1.91,139.7 JP1.1 8.26,141.13 13.18,146.05 C6.2 19.68,142.88 | C2.1 1.91,78.11 | T5.E 48.9,139.06 | 48.9,139.06 46.35,139.06 JP1.16 46.35,143.51 45.72,144.15 31.11,144.15 JP1.10 JP1.9 JP1.8 JP1.7 23.5,141.6 22.23,142.88 19.68,142.88 | C11.1 25.91,129.03 C4.- | T1.E 48.9,121.92 48.9,139.06 | C4.- V1.8 21.59,116.84 31.75,116.84 V1.13 31.75,111.12 C20.2 | T4.E 46.35,98.42 v46.35,87.99 46.35,86.36 50.16,86.36 50.8,85.72 T6.E | X7.2 18.38,52.66 | v18.41,49.53 18.38,49.57 18.38,52.66 | v18.41,42.55 17.78,43.18 1.91,43.18 | C22.- 29.72,15.37 29.84,15.24 | v31.75,84.45 v30.48,83.19 U$1.22 25.4,83.19 22.86,80.64 U$1.8 17.78,80.64 17.14,81.28 13.34,81.28 12.22,80.16 7.14,80.16 6.99,80.01 | V2.13 30.66,71.75 | V2.8 40.01,82.55 v40.01,84.45 C3.2 v40.01,87.99 | 18.38,52.66 R14.1 C7.2 | H2.P1 48.9,10.79 48.9,14.61 | 24.13,42.55 C1.- | JP1.5 18.41,141.6 19.68,142.88 | C2.1 6.99,80.01
  Bottom 1.016: 6.99,80.01 C30.2
L
  Bottom 1.27: 77.39,31.75 77.39,73.66 | 77.39,73.66 77.39,91.44 | 77.39,91.44 77.39,109.86 | 77.39,109.86 77.39,127.71 76.83,128.27 K4.1 | 77.39,31.75 77.39,19.05 | 77.39,19.05 77.39,5.08 68.62,5.08 X1.2 | 77.39,19.05 D13.C 73.03,17.14 R20.2 | 77.39,31.75 D14.A | K1.1 77.39,109.86 | 77.39,91.44 K3.1 | K5.1 77.39,73.66
N
  Bottom 1.27: X1.1 65.41,10.12 65.41,48.9 68.58,52.07 68.58,59.05 66.67,60.96 66.67,67.94 67.27,67.94 67.31,67.91 X4.2 70.48,74.93 74.3,78.74 74.3,85.64 74.25,85.69 X6.2 70.48,93.34 74.3,97.16 74.3,104.14 70.53,104.14 X3.2 70.48,111.12 74.3,114.94 74.3,122.56 70.53,122.56 X5.2 70.48,129.54 74.3,133.35 74.3,140.97 70.53,140.97 X2.2
N$1
  Bottom 1.016: U$1.9 15.88,78.11 | 15.88,78.11 Q2.2 | 15.88,78.11 C2.2
N$4
  Bottom 1.016: U$1.10 15.88,75.56 Q2.1 C8.2
N$8
  Bottom 1.016: K1.4 53.34,112.39 55.24,114.3 55.24,117.47 | 55.24,117.47 T1.C | D10.K 55.24,117.47
N$10
  Bottom 1.27: D12.A 68.58,25.4 68.58,38.1 D11.C
N$11
  Bottom 1.016: R7.1 61.59,117.47 D10.A
N$13
  Bottom 1.016: R9.2 49.53,117.47 52.7,117.47 T1.B
N$15
  Bottom 1.27: D13.A D12.C
N$17
  Bottom 1.27: D14.C 62.23,31.75 62.23,44.45 D15.A
N$18
  Bottom 1.27: D15.C D52.A
N$19
  Bottom 1.016: OK3.1 53.34,15.24 53.98,14.61 R20.1
N$20
  Bottom 1.016: C13.2 49.53,26.67 R21.1 42.55,23.5 42.55,17.78 OK3.4
N$21
  Bottom 1.016: C13.1 43.18,28.57 43.18,30.48 | 43.18,30.48 43.18,33.66 D23.C | D22.A 43.18,30.48
N$23
  Bottom 1.016: R22.1 60.96,70.48 61.28,70.17 61.28,64.45 60.33,63.5 D24.A
N$24
  Bottom 1.016: K2.4 52.7,57.78 55.24,60.33 55.24,63.5 | T3.C 55.24,63.5 | 55.24,63.5 D24.K
N$25
  Bottom 1.016: R23.2 48.9,57.78 52.7,61.59 T3.B
N$34
  Bottom 1.016: D33.A 61.59,99.06 R27.1
N$35
  Bottom 1.016: K3.4 53.34,96.52 55.88,99.06 | T4.C 55.88,99.06 | D33.K 55.88,99.06
N$36
  Bottom 1.016: T4.B 53.34,100.33 50.83,97.82 50.83,92.74 R28.2
N$45
  Bottom 1.016: R32.1 59.69,142.24 D42.A
N$46
  Bottom 1.016: T5.C 55.24,135.89 | D42.K 55.24,135.89 | 55.24,135.89 55.24,132.72 53.34,131.44 K4.4
N$47
  Bottom 1.016: B3.+ 13.34,27.94 R18.2
N$48
  Bottom 1.016: OK7.1 8.89,27.94 R18.1
N$49
  Bottom 1.016: B3.- 12.7,20.95 6.35,20.95 OK7.2
N$51
  Bottom 1.016: OK3.2 54.09,20.44 54.09,37.98 53.34,38.1
  Bottom 1.27: D11.A 53.34,38.1 53.34,50.34 53.65,50.68 57.67,50.68 D52.C 62.23,50.8 65.41,53.98 K2.2
N$52
  Bottom 1.016: R33.2 52.7,133.99 T5.B
N$62
  Bottom 1.016: R14.2 SG1.-
N$64
  Bottom 1.016: R37.1 61.59,80.64 D51.A
N$65
  Bottom 1.016: K5.4 53.34,78.11 55.88,80.64 | 55.88,80.64 T6.C | D51.K 55.88,80.64
N$66
  Bottom 1.016: R38.2 53.34,81.92 T6.B
N$74
  Bottom 1.016: D60.A 23.5,38.73 R42.1
OUT_PUMP
  Bottom 1.27: 70.44,80.64 X6.1 70.48,80.64 66.04,76.2 K5.2
OUT_S1_GAS
  Bottom 1.27: K4.2 66.04,131.49 X2.1
OUT_S2_WAT
  Bottom 1.27: K3.2 66.04,94.66 X3.1
OUT_S3_VAP
  Bottom 1.27: X4.1 73.03,60.37 K2.1
OUT_S4_DRY
  Bottom 1.27: K1.2 66.04,113.07 X5.1
RS
  Bottom 1.016: JP1.4 15.88,137.79 18.8,134.87 28.96,134.87 29.84,133.99 29.84,126.63 28.79,125.58 24.61,125.58 24.13,125.09 V1.7
SH1_BUZZER
  Bottom 1.016: SG1.+ V2.1
SH3_EN_PUMP
  Bottom 1.016: R23.1 43.81,50.16 43.81,69.22 V2.3
SH4_EN_S3_VAP
  Bottom 1.016: R38.1 46.35,71.75 V2.4
SH5_EN_S2_WAT
  Bottom 1.016: R28.1 48.9,80.97 42.22,74.3 V2.5
SH6_S4_DRY
  Bottom 1.016: R9.1 47.78,107.95 44.45,104.62 44.45,84.37 45.26,83.56 45.26,80.03 42.06,76.83 V2.6
SH7_EN_S1_GAS
  Bottom 1.016: R33.1 43.97,131.93 43.97,106.83 42.55,105.41 42.55,83.58 43.36,82.77 43.36,80.82 41.91,79.38 V2.7
TCK+
  Bottom 0.61: U1.3 15.24,56.52 10.79,56.52 10.79,60.33 8.57,62.55 8.29,62.83 7.62,63.5 U$2.2
TCK-
  Bottom 0.61: U1.2 16.51,54.61 9.53,54.61 7.62,56.52 U$2.1
UNO_REST
  Bottom 1.016: U$1.1 19.68,99.06 R1.1
VEE
  Bottom 1.016: JP1.3 13.34,137.31 16.51,134.14 R11.1 16.51,132.72 21.46,132.72 | 21.46,132.72 C4.+ | C11.2 21.46,132.72
VIN
  Bottom 1.016: IC2.IN 15.24,6.35 15.24,16.51 15.88,17.14 24.77,17.14 25.4,17.78 25.4,20.32 | B2.+ 23.5,31.75 R42.2 24.77,28.57 C23.2 24.77,26.82 25.4,26.19 25.4,20.32 | C22.+ 25.4,20.32
(copper drawn outside any net)
  shapes: Bottom area x1

### Text on the board
tNames: LCD | 220V
tDocu: S_GAS | S_DRY | SWITCHS | S_WAT | S_VAP | PUMP | POWER | 9V AC | START lite / H/W : V2 / S/W : V2 / MADE IN EGYPT